# Altium schematic sheet Trip Detector.SchDoc
size A4; Author: Thomas Kreppel; CompanyName: Universidad de Santiago de Chile; Address1: Avenida Ecuador Nº 3519; Address2: Estación Central, Santiago; Address3: Chile; DocumentNumber: 9; SheetNumber: 9; SheetTotal: 10
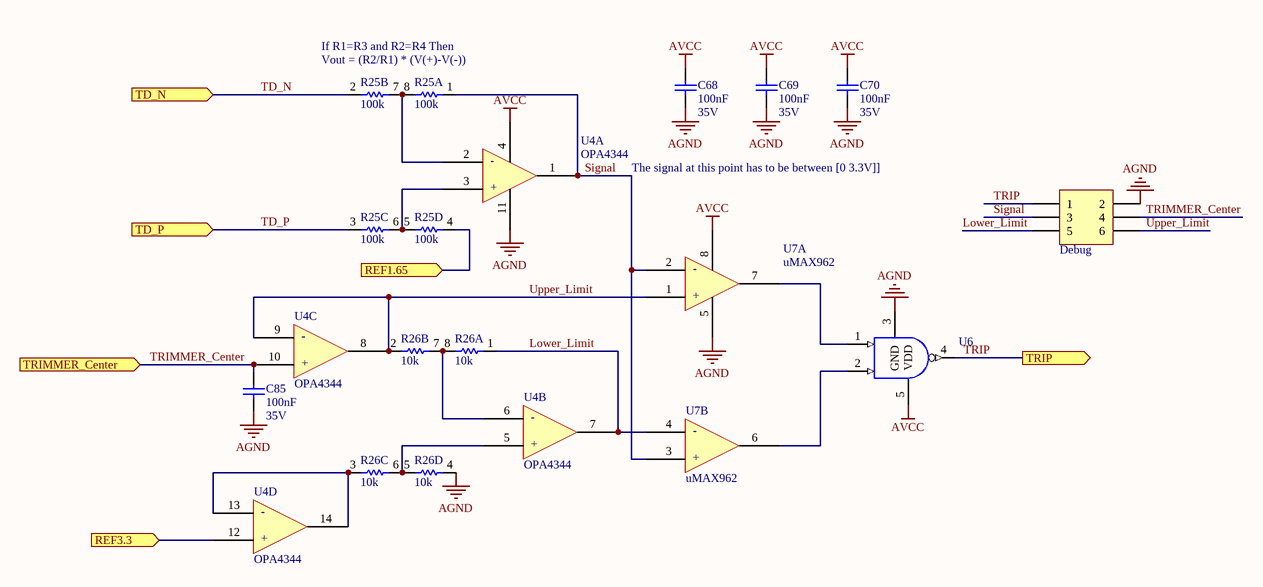
[diagram p0: Trip Detector.SchDoc]

## Parts
C68  100nF  Voltage: 35V  [CAP_0603]
C69  100nF  Voltage: 35V  [CAP_0603]
C70  100nF  Voltage: 35V  [CAP_0603]
C85  100nF  Voltage: 35V  [CAP_0603]
Debug  Connector Header Through Hole, Right Angle 6 position 0.0.79" (2mm)  [Header 3x2 Macho Pitch 1.27mm]  (value not drawn)  (no BOM)
R25  100k  [CAC-80P320X160-8N]  (parts A,B,C,D of 4)
R26  10k  [CAC-80P320X160-8N]  (parts A,B,C,D of 4)
U4  OPA4344  [TSSO5X6-G14/X.3]  (parts A,B,C,D of 4)
U6  MC74VHC1G00DFT1  [SOT-353]  (value not drawn)
U7  uMAX962  [8-MSOP]  (parts A,B of 2)

## Ports
REF1.65 (in), REF3.3 (in), TD_N (in), TD_P (in), TRIMMER_Center (in), TRIP (out)

## Nets
AGND: C68.2 C69.2 C70.2 C85.2 Debug.2 R26.4 U4.11(v-) U6.3(GND) U7.5(GND)
AVCC: C68.1 C69.1 C70.1 U4.4(v+) U6.5(VDD) U7.8(VCC)
Lower_Limit: Debug.5 R26.1 U4.7(out_b) U7.4(-IN_B)
REF1.65: R25.4 ; port REF1.65
REF3.3: U4.12(+in_d) ; port REF3.3
Signal: Debug.3 R25.1 U4.1(out_a) U7.2(-in_a) U7.3(+IN_B)
TD_N: R25.2 ; port TD_N
TD_P: R25.3 ; port TD_P
TRIMMER_Center: C85.1 Debug.4 U4.10(+in_c) ; port TRIMMER_Center
TRIP: Debug.1 U6.4(~{Y}) ; port TRIP
Upper_Limit: Debug.6 R26.2 U4.8(out_c) U4.9(-in_c) U7.1(+in_a)
NetR25_5: R25.5 R25.6 U4.3(+in_a)
NetR25_7: R25.7 R25.8 U4.2(-in_a)
NetR26_3: R26.3 U4.13(-in_d) U4.14(out_d)
NetR26_5: R26.5 R26.6 U4.5(+in_b)
NetR26_7: R26.7 R26.8 U4.6(-in_b)
NetU6_1: U6.1(B) U7.7(out_a)
NetU6_2: U6.2(A) U7.6(OUT_B)

## Notes on the sheet
- (near R25) If R1=R3 and R2=R4 Then
- (near R25) Vout = (R2/R1) * (V(+)-V(-))
- The signal at this point has to be between [0 3.3V]]
- Title
- Size:
- Date:
- A4
- Revision:
- Time:
- Sheet
- of
- Author:
- Project:
- (in symbol MAX962, part A) -; +
- (in symbol MAX962, part B) -; +
- (in symbol OPA4344, part A) -; +
- (in symbol OPA4344, part B) -; +
- (in symbol OPA4344, part C) -; +
- (in symbol OPA4344, part D) -; +

## Library data of the parts
C68-C70 C85 = Cap_0603: Capacitor; MPN: C0603C104M5RACTU; Rule: PcbType=ProtelPcb; MF: KEMET; Dielectricum: X7R; Tolerance: 10%; Published: 8-Jun-2000; LatestRevisionDate: 17-Jul-2002; LatestRevisionNote: Re-released for DXP Platform.; PackageReference: RAD-0.3; Publisher: Altium Limited; Value: 100nF; Supplier 1: Digikey; Supplier 2: Mouser; Supplier Part Number 1: 399-7845-1-ND; Package: 0603
Debug = Header 3x2 Macho_Pitch_1.27mm: Connector Header Through Hole 6 position 0.050" (1.27mm); Manufacturer Part-Number: GRPB032VWVN-RC; Supplier 1: Digikey; Supplier 2: Mouser; Supplier Part Number 1: S9015E-03-ND
R25 = ResArray 1206: Chip Resistor Array 0606, 4xR; Manufacturer: Vishay; Value: 100k; Created: Kreppel_0420; Supplier 1: Digikey; Supplier Part Number 1: 749-1032-1-ND; Supplier 2: Mouser
R26 = ResArray 1206: Chip Resistor Array 0606, 4xR; Manufacturer: Vishay; Manufacturer Part-Number: ACASA1002S1002P100; Value: 10k; Created: Kreppel_0420; Supplier 1: Digikey; Supplier Part Number 1: 749-1023-1-ND; Supplier 2: Mouser
U4 = OPA4344: opamp rai to rail 1mV; Manufacturer Part-Number: OPA4344EA/250; Supplier 1: Digikey; Supplier 2: Mouser; Supplier Part Number 1: OPA4344EACT-ND
U6 = MC74VHC1G00DFT1: 2-Input NAND Gate; Manufacturer Part-Number: MC74VHC1G00DFT1G; Published: 15-Apr-2002; LatestRevisionDate: 12-Dec-2006; LatestRevisionNote: IPC-7351 Footprint Added.; DatasheetVersion: Dec-1999; PackageVersion: Oct-1999; PackageReference: 419A-01; Publisher: Altium Limited; PackageDescription: 5-Pin SOT-353 Package 0.65 mm Pitch, 2.1 mm Lead Span; ComponentLink1Description: Manufacturer Link; ComponentLink1URL: http://www.onsemi.com/; ComponentLink2Description: Datasheet; ComponentLink2URL: http://www.onsemi.com/pub/Collateral/MC74VHC1G00-D.PDF; Supplier 1: Digikey; Supplier 2: Mouser; Supplier Part Number 1: MC74VHC1G00DFT1GOSCT-ND
U7 = MAX962: IC COMPARATOR BTR 8-UMAX; Manufacturer Part-Number: MAX962EUA+; Supplier 1: Digikey; Supplier 2: Mouser; Supplier Part Number 1: MAX962EUA+-ND